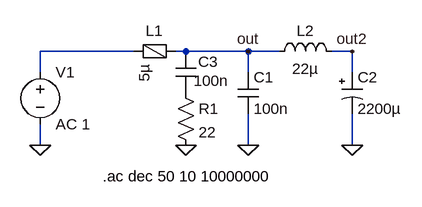
[diagram p0: schematic DCDC_power_input_filter.asc]
DCDC_power_input_filter.asc, the LTspice schematic file:
Version 4
SHEET 1 880 680
WIRE 144 160 0 160
WIRE 224 160 208 160
WIRE 320 160 224 160
WIRE 368 160 320 160
WIRE 480 160 448 160
WIRE 0 192 0 160
WIRE 320 192 320 160
WIRE 480 192 480 160
WIRE 0 304 0 272
WIRE 320 304 320 256
WIRE 480 304 480 256
FLAG 0 304 0
FLAG 320 304 0
FLAG 320 160 out
FLAG 480 304 0
FLAG 480 160 out2
FLAG 224 304 0
SYMBOL FerriteBead 176 160 R90
WINDOW 0 -16 0 VBottom 2
SYMATTR InstName L1
SYMATTR Value 5µ
SYMATTR SpiceLine Ipk=3 Rser=0.0128 Rpar=940 Cpar=10p
SYMBOL voltage 0 176 R0
SYMATTR InstName V1
SYMATTR Value AC 1
SYMBOL cap 304 192 R0
SYMATTR InstName C1
SYMATTR Value 100n
SYMATTR SpiceLine V=10 Irms=5.51 Rser=0.00764395 Lser=0
SYMBOL ind 352 176 R270
WINDOW 0 32 56 VTop 2
WINDOW 3 5 56 VBottom 2
SYMATTR InstName L2
SYMATTR Value 22µ
SYMATTR SpiceLine Ipk=2 Rser=0.2 Rpar=2072.4 Cpar=100p
SYMBOL polcap 464 192 R0
WINDOW 3 24 56 Left 2
SYMATTR Value 2200µ
SYMATTR InstName C2
SYMATTR Description Capacitor
SYMATTR Type cap
SYMATTR SpiceLine V=16 Irms=1.44 Rser=0.01 Lser=0
SYMBOL cap 208 160 R0
WINDOW 0 35 16 Left 2
WINDOW 3 28 45 Left 2
SYMATTR InstName C3
SYMATTR Value 100n
SYMATTR SpiceLine V=10 Irms=5.51 Rser=0.00764395 Lser=0
SYMBOL res 208 208 R0
SYMATTR InstName R1
SYMATTR Value 22
TEXT 96 352 Left 2 !.ac dec 50 10 10000000

The netlist it stands for:
* DCDC_power_input_filter.asc
L1 out N001 5µ Ipk=3 Rser=0.0128 Rpar=940 Cpar=10p
V1 N001 0 AC 1
C1 out 0 100n V=10 Irms=5.51 Rser=0.00764395 Lser=0
L2 out out2 22µ Ipk=2 Rser=0.2 Rpar=2072.4 Cpar=100p
C2 out2 0 2200µ V=16 Irms=1.44 Rser=0.01 Lser=0
C3 out P001 100n V=10 Irms=5.51 Rser=0.00764395 Lser=0
R1 P001 0 22
.ac dec 50 10 10000000
.backanno
.end